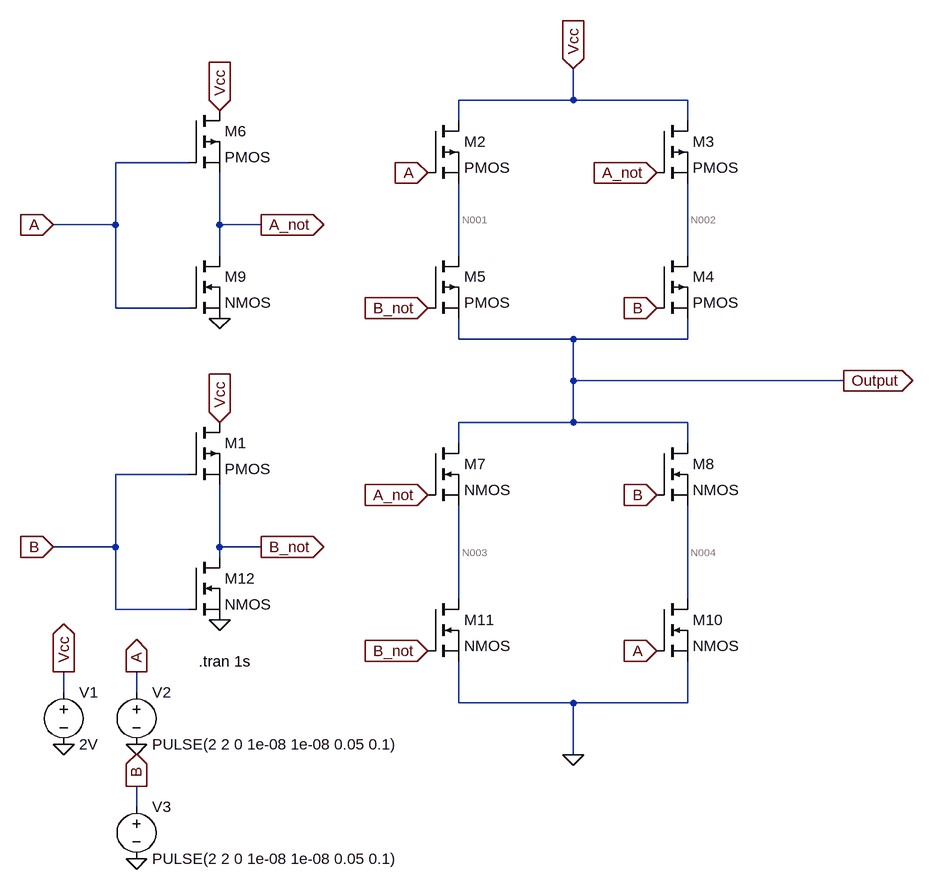
[diagram p0: schematic XOR_NOR_gate.asc]
XOR_NOR_gate.asc, the LTspice schematic file:
Version 4.1
SHEET 1 2048 680
WIRE 720 -1296 720 -1344
WIRE 720 -1296 544 -1296
WIRE 896 -1296 720 -1296
WIRE 544 -1264 544 -1296
WIRE 896 -1264 896 -1296
WIRE 128 -1200 16 -1200
WIRE 16 -1104 16 -1200
WIRE 16 -1104 -80 -1104
WIRE 176 -1104 176 -1184
WIRE 240 -1104 176 -1104
WIRE 176 -1056 176 -1104
WIRE 544 -1056 544 -1168
WIRE 896 -1056 896 -1168
WIRE 16 -976 16 -1104
WIRE 128 -976 16 -976
WIRE 544 -928 544 -960
WIRE 720 -928 544 -928
WIRE 896 -928 896 -960
WIRE 896 -928 720 -928
WIRE 720 -864 720 -928
WIRE 1136 -864 720 -864
WIRE 720 -800 720 -864
WIRE 720 -800 544 -800
WIRE 896 -800 720 -800
WIRE 544 -768 544 -800
WIRE 896 -768 896 -800
WIRE 128 -720 16 -720
WIRE 16 -608 16 -720
WIRE 16 -608 -80 -608
WIRE 176 -608 176 -704
WIRE 240 -608 176 -608
WIRE 176 -592 176 -608
WIRE 544 -528 544 -672
WIRE 896 -528 896 -672
WIRE 16 -512 16 -608
WIRE 128 -512 16 -512
WIRE -64 -384 -64 -416
WIRE 48 -384 48 -416
WIRE 544 -368 544 -432
WIRE 720 -368 544 -368
WIRE 896 -368 896 -432
WIRE 896 -368 720 -368
WIRE 720 -288 720 -368
WIRE 48 -208 48 -240
FLAG -64 -416 Vcc
IOPIN -64 -416 Out
FLAG -64 -304 0
FLAG 48 -416 A
IOPIN 48 -416 Out
FLAG 240 -1104 A_not
IOPIN 240 -1104 Out
FLAG 496 -688 A_not
IOPIN 496 -688 In
FLAG 848 -1184 A_not
IOPIN 848 -1184 In
FLAG 48 -304 0
FLAG 48 -128 0
FLAG 48 -240 B
IOPIN 48 -240 Out
FLAG -80 -1104 A
IOPIN -80 -1104 In
FLAG 176 -1280 Vcc
IOPIN 176 -1280 In
FLAG 176 -960 0
FLAG 176 -800 Vcc
IOPIN 176 -800 In
FLAG -80 -608 B
IOPIN -80 -608 In
FLAG 176 -496 0
FLAG 240 -608 B_not
IOPIN 240 -608 Out
FLAG 1136 -864 Output
IOPIN 1136 -864 Out
FLAG 848 -688 B
IOPIN 848 -688 In
FLAG 848 -976 B
IOPIN 848 -976 In
FLAG 496 -1184 A
IOPIN 496 -1184 In
FLAG 848 -448 A
IOPIN 848 -448 In
FLAG 496 -448 B_not
IOPIN 496 -448 In
FLAG 496 -976 B_not
IOPIN 496 -976 In
FLAG 720 -288 0
FLAG 720 -1344 Vcc
IOPIN 720 -1344 In
SYMBOL voltage -64 -400 R0
WINDOW 123 0 0 Left 0
WINDOW 39 0 0 Left 0
SYMATTR InstName V1
SYMATTR Value 2V
SYMBOL pmos 128 -800 R0
SYMATTR InstName M1
SYMBOL pmos 496 -1264 R0
SYMATTR InstName M2
SYMBOL pmos 848 -1264 R0
SYMATTR InstName M3
SYMBOL pmos 848 -1056 R0
SYMATTR InstName M4
SYMBOL pmos 496 -1056 R0
SYMATTR InstName M5
SYMBOL pmos 128 -1280 R0
SYMATTR InstName M6
SYMBOL nmos 496 -768 R0
SYMATTR InstName M7
SYMBOL nmos 848 -768 R0
SYMATTR InstName M8
SYMBOL nmos 128 -1056 R0
SYMATTR InstName M9
SYMBOL nmos 848 -528 R0
SYMATTR InstName M10
SYMBOL nmos 496 -528 R0
SYMATTR InstName M11
SYMBOL nmos 128 -592 R0
SYMATTR InstName M12
SYMBOL voltage 48 -400 R0
WINDOW 123 0 0 Left 0
WINDOW 39 0 0 Left 0
SYMATTR InstName V2
SYMATTR Value PULSE(2 2 0 1e-08 1e-08 0.05 0.1)
SYMBOL voltage 48 -224 R0
WINDOW 123 0 0 Left 0
WINDOW 39 0 0 Left 0
SYMATTR InstName V3
SYMATTR Value PULSE(2 2 0 1e-08 1e-08 0.05 0.1)
TEXT 144 -432 Left 2 !.tran 1s

The netlist it stands for:
* XOR_NOR_gate.asc
V1 Vcc 0 2V
M1 Vcc B B_not B_not PMOS
M2 Vcc A N001 N001 PMOS
M3 Vcc A_not N002 N002 PMOS
M4 N002 B Output Output PMOS
M5 N001 B_not Output Output PMOS
M6 Vcc A A_not A_not PMOS
M7 Output A_not N003 N003 NMOS
M8 Output B N004 N004 NMOS
M9 A_not A 0 0 NMOS
M10 N004 A 0 0 NMOS
M11 N003 B_not 0 0 NMOS
M12 B_not B 0 0 NMOS
V2 A 0 PULSE(2 2 0 1e-08 1e-08 0.05 0.1)
V3 B 0 PULSE(2 2 0 1e-08 1e-08 0.05 0.1)
.model NMOS NMOS
.model PMOS PMOS
.lib standard.mos
.tran 1s
.backanno
.end

* Results of the author's LTspice run, read from the files saved beside the schematic
* Operating Point, zero values left out:
*   V(a) = 2 V
*   V(a_not) = 1.43 V
*   V(b) = 2 V
*   V(b_not) = 1.43 V
*   V(n001) = 1.462 V
*   V(n002) = 1.466 V
*   V(n003) = 357.5 mV
*   V(n004) = 394.2 mV
*   V(output) = 924.4 mV
*   V(vcc) = 2 V
*   I(V1) = -96.67 µA
*   Ib(M1) = -36.75 µA
*   Ib(M12) = -1.44 pA
*   Ib(M2) = -10.72 µA
*   Ib(M3) = -9.22 µA
*   Ib(M4) = -12.45 µA
*   Ib(M5) = -10.71 µA
*   Ib(M6) = -36.75 µA
*   Ib(M9) = -1.44 pA
*   Id(M1) = 36.75 µA
*   Id(M10) = 14.22 µA
*   Id(M11) = 8.949 µA
*   Id(M12) = 36.75 µA
*   Id(M2) = 10.72 µA
*   Id(M3) = 12.45 µA
*   Id(M4) = 12.45 µA
*   Id(M5) = 10.72 µA
*   Id(M6) = 36.75 µA
*   Id(M7) = 8.949 µA
*   Id(M8) = 14.22 µA
*   Id(M9) = 36.75 µA
*   Is(M10) = -14.22 µA
*   Is(M11) = -8.949 µA
*   Is(M12) = -36.75 µA
*   Is(M3) = -3.232 µA
*   Is(M5) = -10.16 nA
*   Is(M7) = -8.949 µA
*   Is(M8) = -14.22 µA
*   Is(M9) = -36.75 µA